# Altium project STM32-MiniPi.PrjPcb
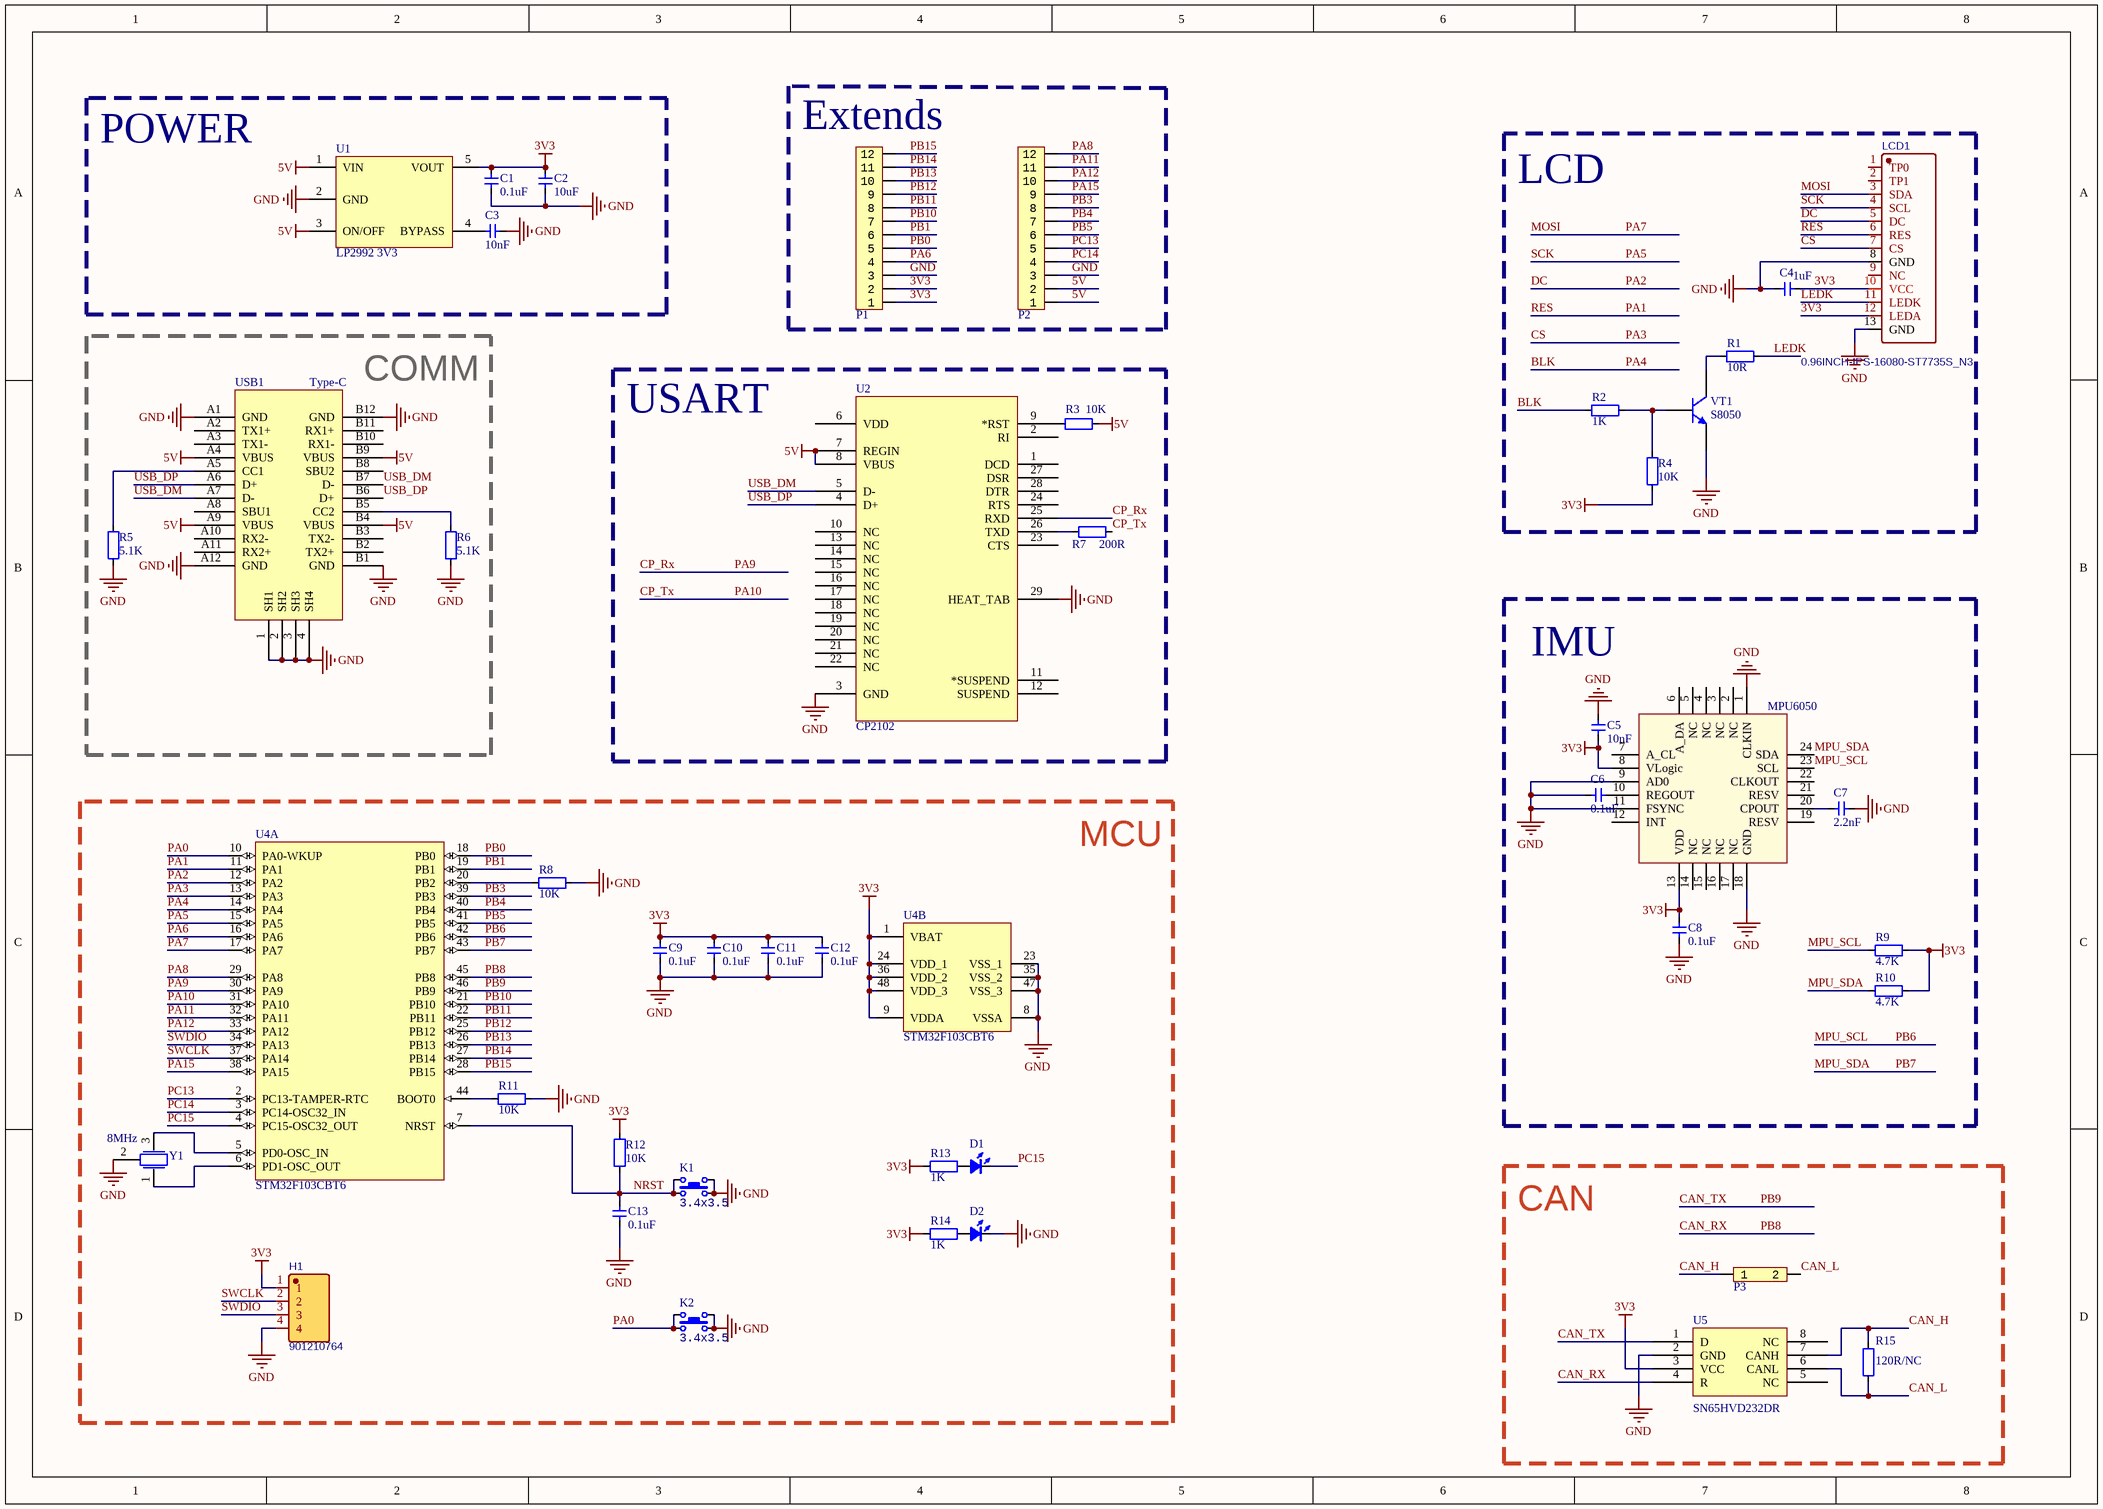
[diagram p0: Main.SchDoc]
1 sheet, 45 parts. Net scope: global (net labels, ports and power ports of the same name join across sheets).
Board file: STM32-MiniPi.PcbDoc

## Sheet Main.SchDoc
size A3; SheetNumber: 1; SheetTotal: 1

### Parts
C1  0.1uF  [CAP_0402]
C2  10uF  [CAP_0402]
C3  10nF  [CAP_0402]
C4  1uF  [CAP_0402]
C5  10nF  [CAP_0402]
C6  0.1uF  [CAP_0402]
C7  2.2nF  [CAP_0402]
C8  0.1uF  [CAP_0402]
C9  0.1uF  [CAP_0402]
C10  0.1uF  [CAP_0402]
C11  0.1uF  [CAP_0402]
C12  0.1uF  [CAP_0402]
C13  0.1uF  [CAP_0402]
D1  color?  [LED_0402_RED]  (value not drawn)
D2  color?  [LED_0402_RED]  (value not drawn)
H1  901210764  [HDR-TH_4P-P2.54-H-M-W11.0]
K1  value 3.4x3.5  [ButtonTACT_3.5*3.55_90]  (hidden comment: TACT 4P)
K2  value 3.4x3.5  [ButtonTACT_3.5*3.55_90]  (hidden comment: TACT 4P)
LCD1  0.96INCH-IPS-16080-ST7735S_N3  [LCD-0.96INCH-IPS-TFT-16080-ST7735S]
P1  HDR1x12_2.54  [HDR1X12_2.54_180]  (value not drawn)
P2  HDR1x12_2.54  [HDR1X12_2.54_180]  (value not drawn)
P3  HDR2x1_2.54  [HDR1X2_2.54_180]  (value not drawn)
R1  10R  [RES_0402]
R2  1K  [RES_0402]
R3  10K  [RES_0402]
R4  10K  [RES_0402]
R5  5.1K  [RES_0402]
R6  5.1K  [RES_0402]
R7  200R  [RES_0402]
R8  10K  [RES_0402]
R9  4.7K  [RES_0402]
R10  4.7K  [RES_0402]
R11  10K  [RES_0402]
R12  10K  [RES_0402]
R13  1K  [RES_0402]
R14  1K  [RES_0402]
R15  120R/NC  [RES_0402]
U1  LP2992 3V3  [SOT23-5]
U2  CP2102  [QFN-28]
U3  MPU6050  [QFN-24]
U4  STM32F103CBT6  [LQFP-48]  (parts A,B of 2)
U5  Manufacturer Part Number: SN65HVD232DR  [SO-8]  (hidden comment: SN65HVD232D)
USB1  Type-C  [Type-C-TOP]
VT1  S8050  [SMT_TRIODE_NPN]
Y1  8MHz  [晶振-3P]

### Blocks framed on the sheet
POWER: C1-C3 U1
Extends: P1 P2
COMM: R5 R6 USB1
USART: R3 R7 U2
IMU: C5-C8 R9 R10 U3
MCU: C9-C13 D1 D2 H1 K1 K2 R8 R11-R14 U4 Y1
CAN: P3 R15 U5

### Nets
3V3: C1.2 C2.2 C4.1 C5.1 C8.2 C9.2 C10.2 C11.2 C12.2 H1.1 LCD1.10(VCC) LCD1.12(LEDA) P1.1 P1.2 R4.1 R9.2 R10.2 R12.2 R13.1 R14.1 U1.5(VOUT) U3.8(VLogic) U3.13(VDD) U4.1(VBAT) U4.9(VDDA) U4.24(VDD_1) U4.36(VDD_2) U4.48(VDD_3) U5.3(VCC)
5V: P2.1 P2.2 R3.1 U1.1(VIN) U1.3(ON/OFF) U2.7(REGIN) U2.8(VBUS) USB1.A4(VBUS) USB1.A9(VBUS) USB1.B4(VBUS) USB1.B9(VBUS)
GND: C1.1 C2.1 C3.1 C4.2 C5.2 C6.2 C7.1 C8.1 C9.1 C10.1 C11.1 C12.1 C13.1 D2.2(K) H1.4 K1.2 K1.4 K2.2 K2.4 LCD1.8(GND) LCD1.13(GND) P1.3 P2.3 R5.2 R6.2 R8.1 R11.1 U1.2(GND) U2.3(GND) U2.29(HEAT_TAB) U3.1(CLKIN) U3.9(AD0) U3.11(FSYNC) U3.18(GND) U4.8(VSSA) U4.23(VSS_1) U4.35(VSS_2) U4.47(VSS_3) U5.2(GND) USB1.1(SH1) USB1.2(SH2) USB1.3(SH3) USB1.4(SH4) USB1.A1(GND) USB1.A12(GND) USB1.B1(GND) USB1.B12(GND) VT1.2(E) Y1.2
BLK: R2.1 U4.14(PA4)  [also labelled PA4]
CAN_H: P3.1 R15.1 U5.7(CANH)
CAN_L: P3.2 R15.2 U5.6(CANL)
CAN_RX: U4.45(PB8) U5.4(R)  [also labelled PB8]
CAN_TX: U4.46(PB9) U5.1(D)  [also labelled PB9]
CP_Rx: U2.25(RXD) U4.30(PA9)  [also labelled PA9]
CP_Tx: R7.1 U4.31(PA10)  [also labelled PA10]
CS: LCD1.7(CS) U4.13(PA3)  [also labelled PA3]
DC: LCD1.5(DC) U4.12(PA2)  [also labelled PA2]
LEDK: LCD1.11(LEDK) R1.2
MOSI: LCD1.3(SDA) U4.17(PA7)  [also labelled PA7]
MPU_SCL: R9.1 U3.23(SCL) U4.42(PB6)  [also labelled PB6]
MPU_SDA: R10.1 U3.24(SDA) U4.43(PB7)  [also labelled PB7]
NRST: C13.2 K1.1 K1.3 R12.1 U4.7(NRST)
PA0: K2.1 K2.3 U4.10(PA0-WKUP)
PA1: LCD1.6(RES) U4.11(PA1)  [also labelled RES]
PA5: LCD1.4(SCL) U4.15(PA5)  [also labelled SCK]
PA6: P1.4 U4.16(PA6)
PA8: P2.12 U4.29(PA8)
PA11: P2.11 U4.32(PA11)
PA12: P2.10 U4.33(PA12)
PA15: P2.9 U4.38(PA15)
PB0: P1.5 U4.18(PB0)
PB1: P1.6 U4.19(PB1)
PB3: P2.8 U4.39(PB3)
PB4: P2.7 U4.40(PB4)
PB5: P2.6 U4.41(PB5)
PB10: P1.7 U4.21(PB10)
PB11: P1.8 U4.22(PB11)
PB12: P1.9 U4.25(PB12)
PB13: P1.10 U4.26(PB13)
PB14: P1.11 U4.27(PB14)
PB15: P1.12 U4.28(PB15)
PC13: P2.5 U4.2(PC13-TAMPER-RTC)
PC14: P2.4 U4.3(PC14-OSC32_IN)
PC15: D1.2(K) U4.4(PC15-OSC32_OUT)
SWCLK: H1.2 U4.37(PA14)
SWDIO: H1.3 U4.34(PA13)
USB_DM: U2.5(D-) USB1.A7(D-) USB1.B7(D-)
USB_DP: U2.4(D+) USB1.A6(D+) USB1.B6(D+)
NetC3_2: C3.2 U1.4(BYPASS)
NetC6_1: C6.1 U3.10(REGOUT)
NetC7_2: C7.2 U3.20(CPOUT)
NetD1_1: D1.1(A) R13.2
NetD2_1: D2.1(A) R14.2
NetR1_1: R1.1 VT1.3(C)
NetR2_2: R2.2 R4.2 VT1.1(B)
NetR3_2: R3.2 U2.9(*RST)
NetR5_1: R5.1 USB1.A5(CC1)
NetR6_1: R6.1 USB1.B5(CC2)
NetR7_2: R7.2 U2.26(TXD)
NetR8_2: R8.2 U4.20(PB2)
NetR11_2: R11.2 U4.44(BOOT0)
NetU4_5: U4.5(PD0-OSC_IN) Y1.3
NetU4_6: U4.6(PD1-OSC_OUT) Y1.1

Not connected (* = marked no-connect by the designer): LCD1 1(TP0) 2(TP1) 9(NC); U2 1(DCD) 2(RI) 6(VDD) 10(NC) 11(*SUSPEND) 12(SUSPEND) 13(NC) 14(NC) 15(NC) 16(NC) 17(NC) 18(NC) 19(NC) 20(NC) 21(NC) 22(NC) 23(CTS) 24(RTS) 27(DSR) 28(DTR); U3 2(NC) 3(NC) 4(NC) 5(NC) 6(A_DA) 7(A_CL) 12(INT) 14(NC) 15(NC) 16(NC) 17(NC) 19(RESV) 21(RESV) 22(CLKOUT); U5 5(NC) 8(NC); USB1 A2(TX1+) A3(TX1-) A8(SBU1) A10(RX2-) A11(RX2+) B2(TX2+) B3(TX2-) B8(SBU2) B10(RX1-) B11(RX1+)

### Notes on the sheet
- LCD

### Library data of the parts
C1-C13 = 电容-0402: Capacitor; Value: 0.1u
D1 D2 = LED_0402: LED; Type: 0402; Value: color?
H1 = 901210764: BOM_Manufacturer: MOLEX; Contributor: LCSC; BOM_Supplier: LCSC; BOM_Supplier Part: C293357; BOM_Manufacturer Part: 901210764; BOM_JLCPCB Part Class: Extended Part; spicePre: H; spiceSymbolName: 901210764
K1 K2 = ButtonTACT: Button; type: TACT 4P
LCD1 = 0.96INCH-IPS-16080-ST7735S_N3: Contributor: micespring; spicePre: L; spiceSymbolName: 0.96INCH-IPS-16080-ST7735S_N3
P1 P2 = HDR1x12_2.54: Header
P3 = HDR2x1_2.54: Header
R1-R15 = 电阻-0402: Resistor; Value: 22R
U1 = LP2992: LDO
U2 = CP2102: USB转TTL; PART DESC: SINGLE-CHIP USB TO UART BRIDGE, QFN28, RoHS.; MFG #1: SILICON LABS; PART NUMBER: CP2102; Value: Value; RefDes: RefDes; Type: DEV
U3 = MPU6050: 六轴传感器
U4 = STM32F103CBT6: ARM Cortex-M3 32-bit MCU, 128 KB Flash, 20 KB Internal RAM, 37 I/Os, 48-pin LQFP, -40 to 85 degC, Tray; A/D Converter: 2x12-bit (10 Channel); FLASH Size (Prog) (kB): 128; I/Os (High Current): 37; Internal RAM Size (kB): 20; Operating Frequency(F) (Processor speed) (MHz): 72; Supply Voltage(Vcc) min (V): 2; DatasheetVersion: Rev. 16; PackageVersion: Rev. 6, 06/2013; PackageReference: LQFP48; PackageDescription: 48-Pin Low Profile Quad Flat Package, 7 x 7 mm Body, 0.5 mm Pitch; Supplier 1: Digi-Key; Supplier Part Number 1: 497-6288-ND; Supplier 2: Farnell; Supplier Part Number 2: 1606327; Supplier 3: Newark; Supplier Part Number 3: 11N8296; Supplier 4: Newark; Supplier Part Number 4: 57P1214; Supplier 5: Mouser; Supplier Part Number 5: 511-STM32F103CBT6; Core: ARM Cortex-M3; Packing: Tray; Mounting Technology: Surface Mount; PartNumber: STM32F103CBT6; ComponentLink1Description: Manufacturer URL; ComponentLink1URL: http://www.st.com/web/en/home.html; ComponentLink2Description: Datasheet; ComponentLink2URL: http://www.st.com/st-web-ui/static/active/en/resource/technical/document/datasheet/CD00161566.pdf; ComponentLink3Description: Package Specification; ComponentLink3URL: http://www.st.com/st-web-ui/static/active/en/resource/technical/document/datasheet/DM00058181.pdf
U5 = SN65HVD232D: Manufacturer: Texas Instruments; Protocol: CAN; Number of Drivers/Receivers: 1/1; Duplex: Half; Data Rate: 1Mbps; Voltage - Supply: 3 V ~ 3.6 V; Supplier 1: Digi-Key; Supplier Part Number 1: 296-26344-2-ND; RoHS: RoHS Compliant; Category: Integrated Circuits (ICs); Stock: 5000; Pricing 1: 2500=0.84375 (USD); Packaging: Tape & Reel (TR); Part Status: Active; Type: Transceiver; Operating Temperature: -40°C ~ 85°C; Mounting Type: Surface Mount; Package / Case: 8-SOIC (0.154", 3.90mm Width); Supplier Device Package: 8-SOIC; ComponentLink1URL: http://www.ti.com/lit/ds/symlink/sn65hvd230.pdf; ComponentLink1Description: http://www.ti.com/lit/ds/symlink/sn65hvd230.pdf; Supplier 2: Digi-Key; Supplier Part Number 2: 296-26344-1-ND; Pricing 2: 1=2.05, 10=1.842, 100=1.4809, 500=1.21668, 1000=1.00811 (USD)
USB1 = USB-Type-C-TOP
VT1 = SMT_TRIODE_NPN: Surface mount NPN transistor, package SOT-23
Y1 = 晶振-3Pin: 村田贴片